# Altium schematic sheet 3V3 LDO.SchDoc
size A4; SheetNumber: 2; SheetTotal: 12
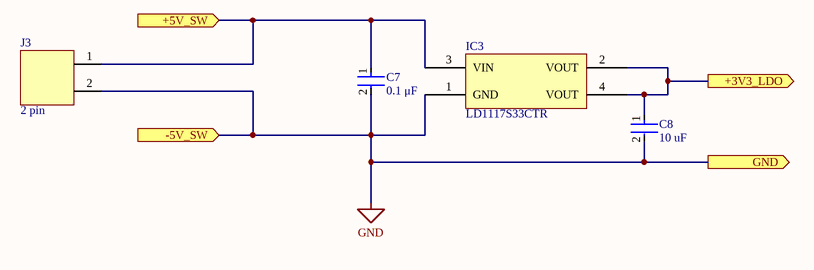
[diagram p0: 3V3 LDO.SchDoc]

## Parts
C7  0.1 μF  [FP-C0805C-DN-MFG]
C8  10 uF  [FP-C0805C-DG-MFG]
IC3  LD1117S33CTR  [LD1117]
J3  2 pin  [2 pin terminal 5mm]

## Ports
+3V3_LDO (out, see Callisto Control Board[4A], BME280[2B], Driver Board[1B], INA219_CH1[1A], INA219_CH2[1B], INA219_CH3[1B], INA219_CH4[1B], INA219_CH5[1B], INA219_CH6[1B]), +5V_SW (in, see Callisto Control Board[3A], 5V_SMPS[3B]), -5V_SW (in, see Callisto Control Board[3A], 5V_SMPS[3B]), GND (out, see Callisto Control Board[4A], BME280[3B], Driver Board[1B], INA219_CH1[1A], INA219_CH2[1B], INA219_CH3[1B], INA219_CH4[1B], INA219_CH5[1B], INA219_CH6[1B], Raspberry Pi[1C])

## Nets
GND: C7.2 C8.2 IC3.1(GND) J3.2 ; port -5V_SW, port GND
+3V3_LDO: C8.1 IC3.2(VOUT) IC3.4(VOUT) ; port +3V3_LDO
+5V_SW: C7.1 IC3.3(VIN) J3.1 ; port +5V_SW

## Library data of the parts
C7 = CMP-03020-002581-2: C0805 0.10 μF X7R 30ppm/°C 20.00% 50 V C0805C104M5RAC; Manufacturer: KEMET; Voltage Rating: 50 V; Tolerance: 0.2; Material: Ceramic; Category: Cap; Temperature: -55°C to +125°C; Lead Free: Yes; Device Class L3: Ceramic Capacitors; Package: C0805C-DN; Capacitance: 0.1 μF; Height: 0.88mm; Temperature Range High: +125°C; Device Class L2: Capacitors; Manufacturer Part Number: C0805C104M5RAC; Device Class L1: Passive Components; Temperature Coefficient: 30ppm/°C; ComponentLink2Description: Datasheet; RoHS: TRUE; Temperature Range Low: -55°C; Value: 0.1 μF; ComponentLink2URL: https://content.kemet.com/datasheets/KEM_C1003_C0G_SMD.pdf; Temperature Characteristic: X7R; Mouser Description: Multilayer Ceramic Capacitors MLCC - SMD/SMT 50volts 0.1uF 20% X7R; Octopart: https://octopart.com/c0805c104m5rac-kemet-2226142; Ipc Land Pattern Name: CAPC200125X78; Automotive: No
C8 = CMP-2007-03243-2: CAP CER 10UF 10V X5R 0805 / C0805C106K8PACTU; Manufacturer: Kemet; 3DS Part Number: 220-00001; Tolerance: 10%; Temperature Coefficient: 15%; Material: Ceramic; Device Class L2: Capacitors; Device Class L1: Passive Components; ComponentLink2URL: https://content.kemet.com/datasheets/KEM_C1006_X5R_SMD.pdf; Height: 1.4mm; Lead Free: Yes; Manufacturer Part Number: C0805C106K8PACTU; Digikey Description: CAP CER 10UF 10V X5R 0805; Octopart: https://octopart.com/c0805c106k8pactu-kemet-98697; Capacitance: 10 uF; Value: 10 uF; Temperature Range Low: -55°C; Temperature: -55°C to +85°C; Automotive: No; Mouser Description: CAP CER 10UF 10V X5R 0805; Ipc Land Pattern Name: CAPC200125X125; Temperature Range High: +85°C; Voltage: 10V; RoHS: TRUE; Device Class L3: Ceramic Capacitors; ComponentLink2Description: Datasheet; Voltage Rating: 10V; Package: C0805C-DG; Temperature Characteristic: X5R; Category: Cap
IC3 = LD1117S33CTR: IC REG LINEAR 3.3V 800MA SOT223
J3 = 2 pin terminal block 5 mm